# EAGLE design moth_v3.0 (EAGLE 9.5.2)
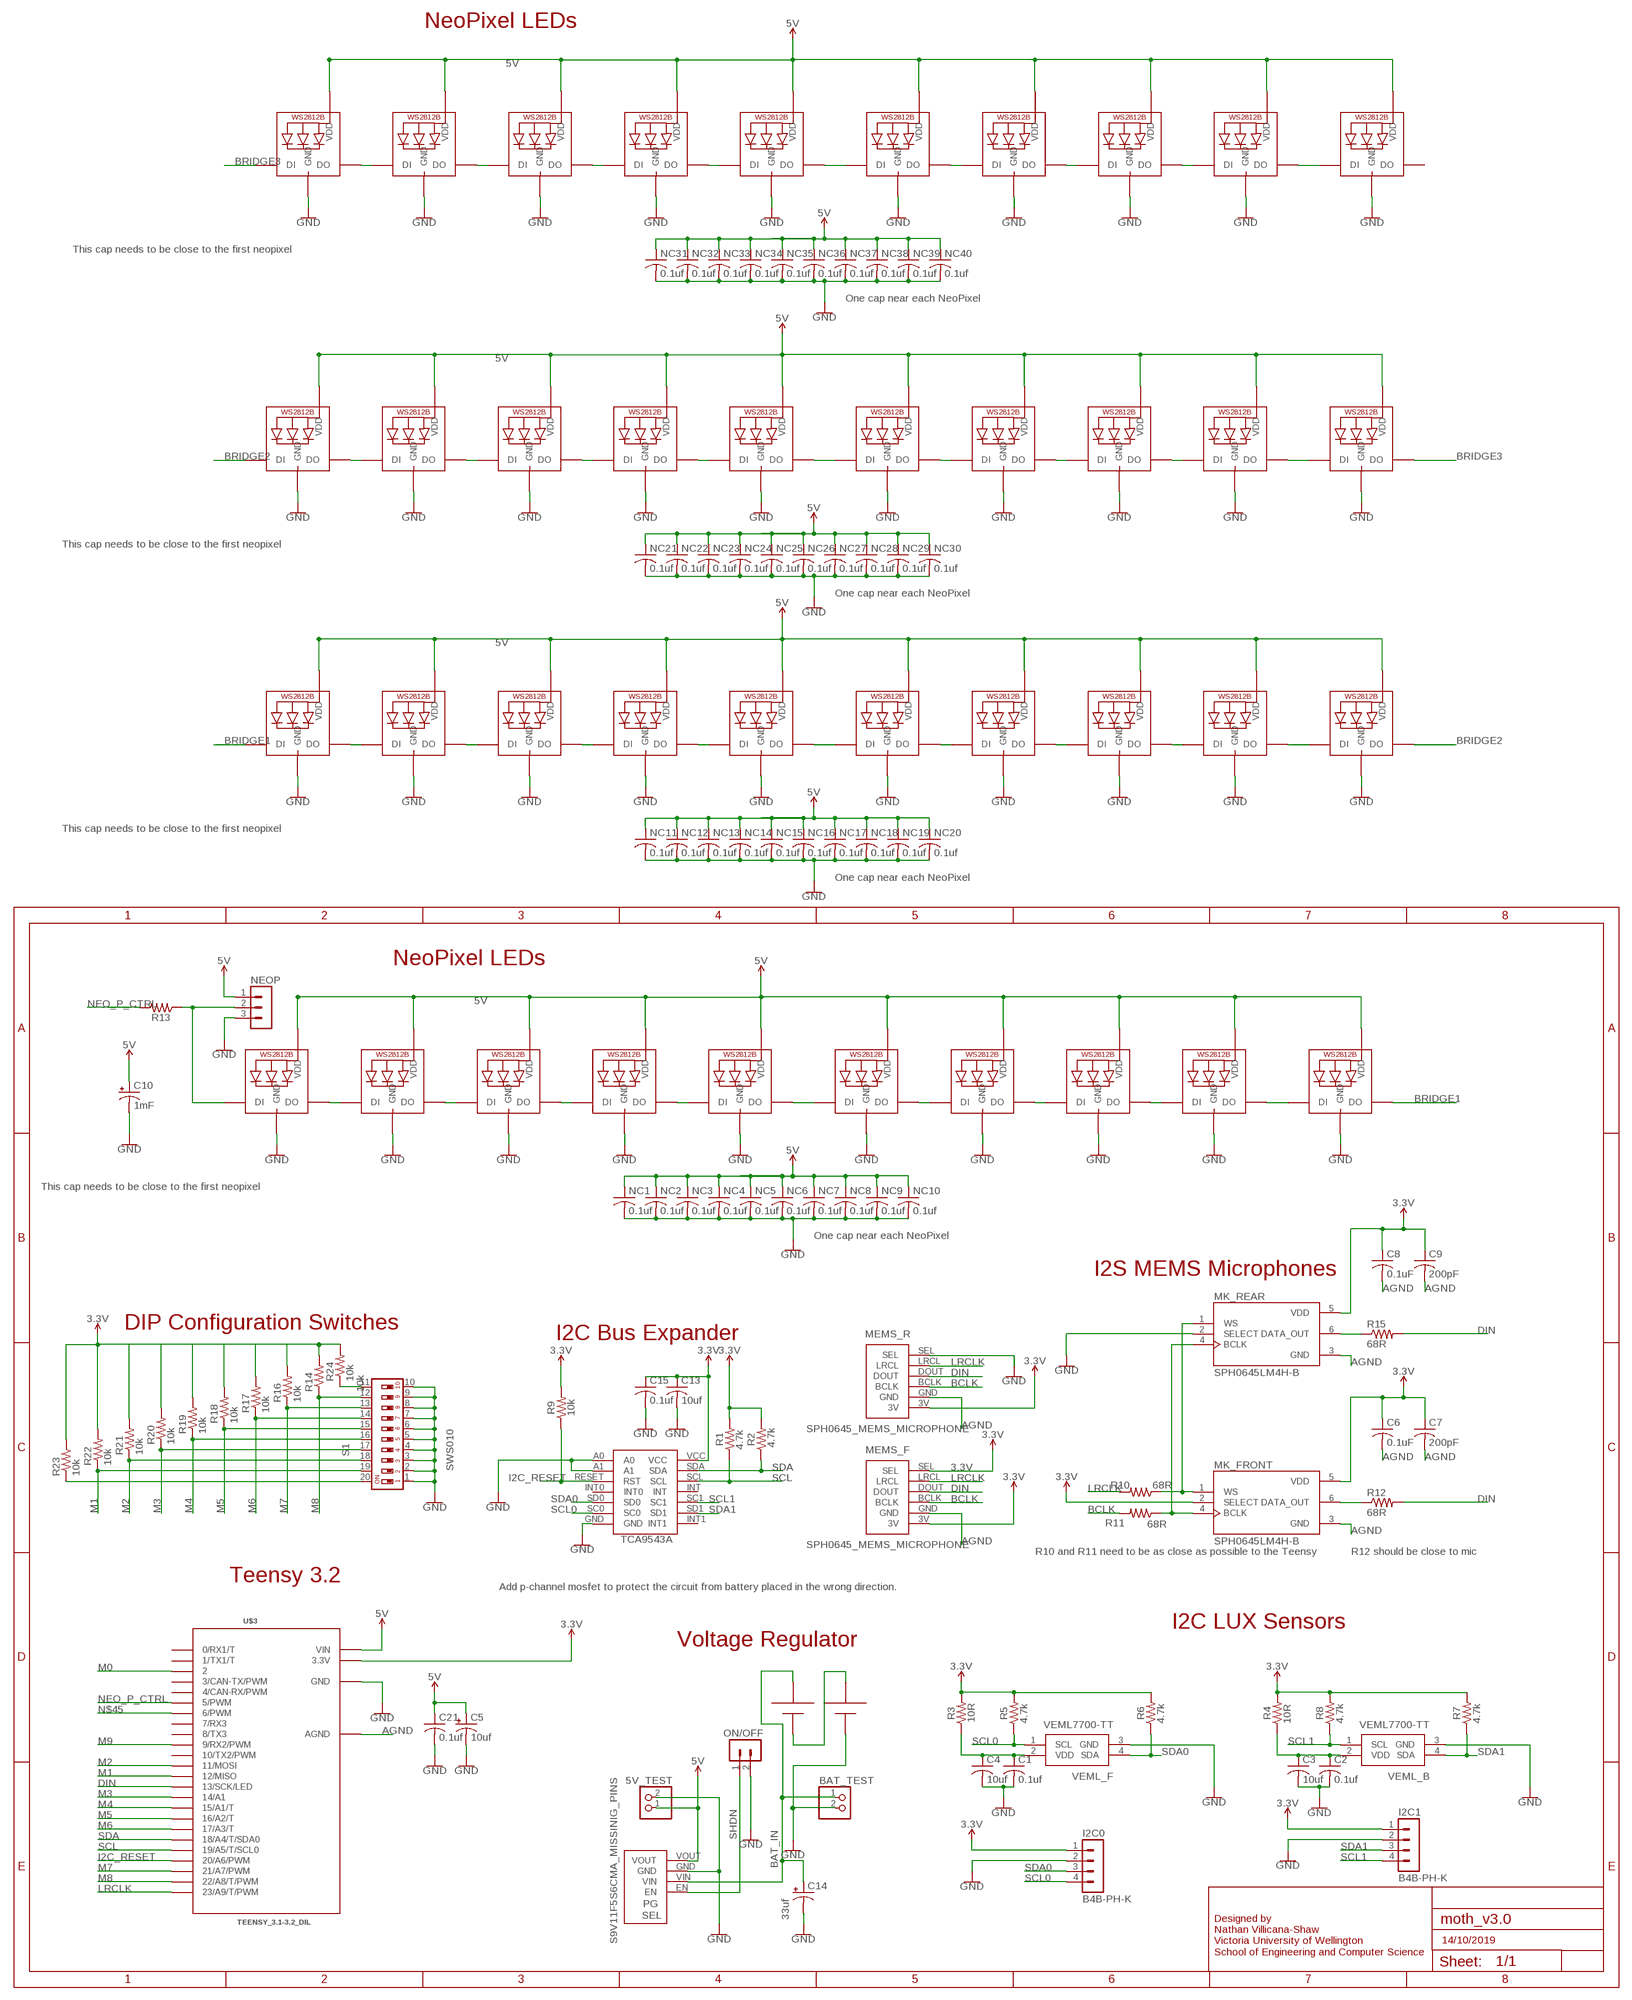
[diagram p0: schematic, sheet 1]

## Parts
5V_TEST  PINHD-1X2  [1X02]
BAT_TEST  PINHD-1X2  [1X02]
C1  0.1uf  C-USC1206K  [C1206K]
C2  0.1uf  C-USC1206K  [C1206K]
C3  10uf  C-USC1206K  [C1206K]
C4  10uf  C-USC1206K  [C1206K]
C5  10uf  CPOL-USE2.5-6  [E2,5-6]
C6  0.1uF  C-USC1206K  [C1206K]
C7  200pF  C-USC1206K  [C1206K]
C8  0.1uF  C-USC1206K  [C1206K]
C9  200pF  C-USC1206K  [C1206K]
C10  1mF  1000UF-RADIAL-5MM-25V-20%  [CPOL-RADIAL-5MM-10MM]
C13  10uf  C-USC1206K  [C1206K]
C14  33uf  CPOL-USE2-5  [E2-5]
C15  0.1uf  C-USC1206K  [C1206K]
C21  0.1uf  C-USC1206K  [C1206K]
I2C0  B4B-PH-K  [B4B-PH-K]
I2C1  B4B-PH-K  [B4B-PH-K]
MEMS_F  SPH0645_MEMS_MICROPHONE  [SPH0645]
MEMS_R  SPH0645_MEMS_MICROPHONE  [SPH0645]
MK_FRONT  SPH0645LM4H-B  [MIC_SPH0645LM4H-B]
MK_REAR  SPH0645LM4H-B  [MIC_SPH0645LM4H-B]
NC1  0.1uf  C-USC1206K  [C1206K]
NC2  0.1uf  C-USC1206K  [C1206K]
NC3  0.1uf  C-USC1206K  [C1206K]
NC4  0.1uf  C-USC1206K  [C1206K]
NC5  0.1uf  C-USC1206K  [C1206K]
NC6  0.1uf  C-USC1206K  [C1206K]
NC7  0.1uf  C-USC1206K  [C1206K]
NC8  0.1uf  C-USC1206K  [C1206K]
NC9  0.1uf  C-USC1206K  [C1206K]
NC10  0.1uf  C-USC1206K  [C1206K]
NC11  0.1uf  C-USC1206K  [C1206K]
NC12  0.1uf  C-USC1206K  [C1206K]
NC13  0.1uf  C-USC1206K  [C1206K]
NC14  0.1uf  C-USC1206K  [C1206K]
NC15  0.1uf  C-USC1206K  [C1206K]
NC16  0.1uf  C-USC1206K  [C1206K]
NC17  0.1uf  C-USC1206K  [C1206K]
NC18  0.1uf  C-USC1206K  [C1206K]
NC19  0.1uf  C-USC1206K  [C1206K]
NC20  0.1uf  C-USC1206K  [C1206K]
NC21  0.1uf  C-USC1206K  [C1206K]
NC22  0.1uf  C-USC1206K  [C1206K]
NC23  0.1uf  C-USC1206K  [C1206K]
NC24  0.1uf  C-USC1206K  [C1206K]
NC25  0.1uf  C-USC1206K  [C1206K]
NC26  0.1uf  C-USC1206K  [C1206K]
NC27  0.1uf  C-USC1206K  [C1206K]
NC28  0.1uf  C-USC1206K  [C1206K]
NC29  0.1uf  C-USC1206K  [C1206K]
NC30  0.1uf  C-USC1206K  [C1206K]
NC31  0.1uf  C-USC1206K  [C1206K]
NC32  0.1uf  C-USC1206K  [C1206K]
NC33  0.1uf  C-USC1206K  [C1206K]
NC34  0.1uf  C-USC1206K  [C1206K]
NC35  0.1uf  C-USC1206K  [C1206K]
NC36  0.1uf  C-USC1206K  [C1206K]
NC37  0.1uf  C-USC1206K  [C1206K]
NC38  0.1uf  C-USC1206K  [C1206K]
NC39  0.1uf  C-USC1206K  [C1206K]
NC40  0.1uf  C-USC1206K  [C1206K]
NEO1  WS2812B5050  [WS2812B]
NEO2  WS2812B5050  [WS2812B]
NEO3  WS2812B5050  [WS2812B]
NEO4  WS2812B5050  [WS2812B]
NEO5  WS2812B5050  [WS2812B]
NEO6  WS2812B5050  [WS2812B]
NEO7  WS2812B5050  [WS2812B]
NEO8  WS2812B5050  [WS2812B]
NEO9  WS2812B5050  [WS2812B]
NEO10  WS2812B5050  [WS2812B]
NEO11  WS2812B5050  [WS2812B]
NEO12  WS2812B5050  [WS2812B]
NEO13  WS2812B5050  [WS2812B]
NEO14  WS2812B5050  [WS2812B]
NEO15  WS2812B5050  [WS2812B]
NEO16  WS2812B5050  [WS2812B]
NEO17  WS2812B5050  [WS2812B]
NEO18  WS2812B5050  [WS2812B]
NEO19  WS2812B5050  [WS2812B]
NEO20  WS2812B5050  [WS2812B]
NEO21  WS2812B5050  [WS2812B]
NEO22  WS2812B5050  [WS2812B]
NEO23  WS2812B5050  [WS2812B]
NEO24  WS2812B5050  [WS2812B]
NEO25  WS2812B5050  [WS2812B]
NEO26  WS2812B5050  [WS2812B]
NEO27  WS2812B5050  [WS2812B]
NEO28  WS2812B5050  [WS2812B]
NEO29  WS2812B5050  [WS2812B]
NEO30  WS2812B5050  [WS2812B]
NEO31  WS2812B5050  [WS2812B]
NEO32  WS2812B5050  [WS2812B]
NEO33  WS2812B5050  [WS2812B]
NEO34  WS2812B5050  [WS2812B]
NEO35  WS2812B5050  [WS2812B]
NEO36  WS2812B5050  [WS2812B]
NEO37  WS2812B5050  [WS2812B]
NEO38  WS2812B5050  [WS2812B]
NEO39  WS2812B5050  [WS2812B]
NEO40  WS2812B5050  [WS2812B]
NEOP  B3B-PH-K  [B3B-PH-K]
ON/OFF  B2B-PH-K  [B2B-PH-K]
R1  4.7k  R-US_R1206W  [R1206W]
R2  4.7k  R-US_R1206W  [R1206W]
R3  10R  R-US_R1206W  [R1206W]
R4  10R  R-US_R1206W  [R1206W]
R5  4.7k  R-US_R1206W  [R1206W]
R6  4.7k  R-US_R1206W  [R1206W]
R7  4.7k  R-US_R1206W  [R1206W]
R8  4.7k  R-US_R1206W  [R1206W]
R9  10k  R-US_R1206W  [R1206W]
R10  68R  R-US_M1206  [M1206]
R11  68R  R-US_M1206  [M1206]
R12  68R  R-US_M1206  [M1206]
R13  300 R  R-US_R1206W  [R1206W]
R14  10k  R-US_R1206W  [R1206W]
R15  68R  R-US_M1206  [M1206]
R16  10k  R-US_R1206W  [R1206W]
R17  10k  R-US_R1206W  [R1206W]
R18  10k  R-US_R1206W  [R1206W]
R19  10k  R-US_R1206W  [R1206W]
R20  10k  R-US_R1206W  [R1206W]
R21  10k  R-US_R1206W  [R1206W]
R22  10k  R-US_R1206W  [R1206W]
R23  10k  R-US_R1206W  [R1206W]
R24  10k  R-US_R1206W  [R1206W]
S1  SWS010  [SMS-010]
U$1  TCA9543A  [SO14]
U$2  BK-18650-PC4  [18650-PC4]
U$3  TEENSY_3.1-3.2_DIL  [TEENSY_3.0-3.2&LC_DIL]
U$6  S9V11F5S6CMA_MISSINIG_PINS  [S9V11F3S5CMA_MISSING_PINS]
VEML_B  VEML7700-TT  [VEML7700]
VEML_F  VEML7700-TT  [VEML7700]

## Nets
3.3V: C6.1 C7.1 C8.1 C9.1 C13.1 C15.1 I2C0.1 I2C1.1 MEMS_F.3V MEMS_F.SEL MEMS_R.3V MK_FRONT.2(SELECT) MK_FRONT.5(VDD) MK_REAR.5(VDD) R1.2 R2.2 R3.2 R4.2 R5.2 R6.2 R7.2 R8.2 R9.2 R14.2 R22.2 R23.2 R24.2 U$1.VCC U$3.3.3V
5V: 5V_TEST.1 C5.+ C10.+ C21.1 NC1.1 NC2.1 NC3.1 NC4.1 NC5.1 NC6.1 NC7.1 NC8.1 NC9.1 NC10.1 NC11.1 NC12.1 NC13.1 NC14.1 NC15.1 NC16.1 NC17.1 NC18.1 NC19.1 NC20.1 NC21.1 NC22.1 NC23.1 NC24.1 NC25.1 NC26.1 NC27.1 NC28.1 NC29.1 NC30.1 NC31.1 NC32.1 NC33.1 NC34.1 NC35.1 NC36.1 NC37.1 NC38.1 NC39.1 NC40.1 NEO1.1-VDD(VDD) NEO2.1-VDD(VDD) NEO3.1-VDD(VDD) NEO4.1-VDD(VDD) NEO5.1-VDD(VDD) NEO6.1-VDD(VDD) NEO7.1-VDD(VDD) NEO8.1-VDD(VDD) NEO9.1-VDD(VDD) NEO10.1-VDD(VDD) NEO11.1-VDD(VDD) NEO12.1-VDD(VDD) NEO13.1-VDD(VDD) NEO14.1-VDD(VDD) NEO15.1-VDD(VDD) NEO16.1-VDD(VDD) NEO17.1-VDD(VDD) NEO18.1-VDD(VDD) NEO19.1-VDD(VDD) NEO20.1-VDD(VDD) NEO21.1-VDD(VDD) NEO22.1-VDD(VDD) NEO23.1-VDD(VDD) NEO24.1-VDD(VDD) NEO25.1-VDD(VDD) NEO26.1-VDD(VDD) NEO27.1-VDD(VDD) NEO28.1-VDD(VDD) NEO29.1-VDD(VDD) NEO30.1-VDD(VDD) NEO31.1-VDD(VDD) NEO32.1-VDD(VDD) NEO33.1-VDD(VDD) NEO34.1-VDD(VDD) NEO35.1-VDD(VDD) NEO36.1-VDD(VDD) NEO37.1-VDD(VDD) NEO38.1-VDD(VDD) NEO39.1-VDD(VDD) NEO40.1-VDD(VDD) NEOP.1 U$3.VIN U$6.VOUT
AGND: C6.2 C7.2 C8.2 C9.2 MEMS_F.GND MEMS_R.GND MK_FRONT.3(GND) MK_REAR.3(GND) U$3.AGND
BAT_IN: BAT_TEST.1 C14.+ U$2.+1 U$6.VIN
BCLK: MEMS_F.BCLK MEMS_R.BCLK R11.2
BCLK_P: MK_FRONT.4(BCLK) MK_REAR.4(BCLK) R11.1
BRIDGE1: NEO10.2-DOUT(DO) NEO14.4-DIN(DI)
BRIDGE2: NEO20.2-DOUT(DO) NEO24.4-DIN(DI)
BRIDGE3: NEO30.2-DOUT(DO) NEO34.4-DIN(DI)
DIN: MEMS_F.DOUT MEMS_R.DOUT R12.2 R15.2 U$3.13(13/SCK/LED)
GND: 5V_TEST.2 BAT_TEST.2 C1.2 C2.2 C3.2 C4.2 C5.- C10.- C13.2 C14.- C15.2 C21.2 I2C0.2 I2C1.2 MEMS_R.SEL MK_REAR.2(SELECT) NC1.2 NC2.2 NC3.2 NC4.2 NC5.2 NC6.2 NC7.2 NC8.2 NC9.2 NC10.2 NC11.2 NC12.2 NC13.2 NC14.2 NC15.2 NC16.2 NC17.2 NC18.2 NC19.2 NC20.2 NC21.2 NC22.2 NC23.2 NC24.2 NC25.2 NC26.2 NC27.2 NC28.2 NC29.2 NC30.2 NC31.2 NC32.2 NC33.2 NC34.2 NC35.2 NC36.2 NC37.2 NC38.2 NC39.2 NC40.2 NEO1.3-GND(GND) NEO2.3-GND(GND) NEO3.3-GND(GND) NEO4.3-GND(GND) NEO5.3-GND(GND) NEO6.3-GND(GND) NEO7.3-GND(GND) NEO8.3-GND(GND) NEO9.3-GND(GND) NEO10.3-GND(GND) NEO11.3-GND(GND) NEO12.3-GND(GND) NEO13.3-GND(GND) NEO14.3-GND(GND) NEO15.3-GND(GND) NEO16.3-GND(GND) NEO17.3-GND(GND) NEO18.3-GND(GND) NEO19.3-GND(GND) NEO20.3-GND(GND) NEO21.3-GND(GND) NEO22.3-GND(GND) NEO23.3-GND(GND) NEO24.3-GND(GND) NEO25.3-GND(GND) NEO26.3-GND(GND) NEO27.3-GND(GND) NEO28.3-GND(GND) NEO29.3-GND(GND) NEO30.3-GND(GND) NEO31.3-GND(GND) NEO32.3-GND(GND) NEO33.3-GND(GND) NEO34.3-GND(GND) NEO35.3-GND(GND) NEO36.3-GND(GND) NEO37.3-GND(GND) NEO38.3-GND(GND) NEO39.3-GND(GND) NEO40.3-GND(GND) NEOP.3 ON/OFF.2 S1.1 S1.2 S1.3 S1.4 S1.5 S1.6 S1.7 S1.8 S1.9 S1.10 U$1.A0 U$1.A1 U$1.GND U$2.-2 U$3.GND U$6.GND VEML_B.3(GND) VEML_F.3(GND)
I2C_RESET: R9.1 U$1.RESET(RST) U$3.20/A6(20/A6/PWM)
LRCLK: MEMS_F.LRCL MEMS_R.LRCL R10.2 U$3.23/A9(23/A9/T/PWM)
LRCLK_P: MK_FRONT.1(WS) MK_REAR.1(WS) R10.1
M0: U$3.2
M1: R22.1 S1.19 U$3.12(12/MISO)
M2: R21.1 S1.18 U$3.11(11/MOSI)
M3: R20.1 S1.17 U$3.14/A0(14/A1)
M4: R19.1 S1.16 U$3.15/A1(15/A1/T)
M5: R18.1 S1.15 U$3.16/A2(16/A2/T)
M6: R17.1 S1.14 U$3.17/A3(17/A3/T)
M7: R16.1 S1.13 U$3.21/A7(21/A7/PWM)
M8: R14.1 S1.12 U$3.22/A8(22/A8/T/PWM)
M9: U$3.9(9/RX2/PWM)
N$1: C1.1 C4.1 R3.1 VEML_F.2(VDD)
N$2: C2.1 C3.1 R4.1 VEML_B.2(VDD)
N$3: MK_FRONT.6(DATA_OUT) R12.1
N$4: NEO2.2-DOUT(DO) NEO3.4-DIN(DI)
N$5: NEO5.2-DOUT(DO) NEO6.4-DIN(DI)
N$6: NEO9.2-DOUT(DO) NEO10.4-DIN(DI)
N$7: NEO11.2-DOUT(DO) NEO12.4-DIN(DI)
N$8: NEO4.2-DOUT(DO) NEO5.4-DIN(DI)
N$9: NEO15.2-DOUT(DO) NEO16.4-DIN(DI)
N$10: NEO3.2-DOUT(DO) NEO4.4-DIN(DI)
N$11: NEO7.2-DOUT(DO) NEO8.4-DIN(DI)
N$12: NEO8.2-DOUT(DO) NEO9.4-DIN(DI)
N$13: NEO17.2-DOUT(DO) NEO18.4-DIN(DI)
N$14: NEO18.2-DOUT(DO) NEO19.4-DIN(DI)
N$15: NEO11.4-DIN(DI) NEO16.2-DOUT(DO)
N$16: NEO13.2-DOUT(DO) NEO17.4-DIN(DI)
N$17: MK_REAR.6(DATA_OUT) R15.1
N$18: NEO12.2-DOUT(DO) NEO13.4-DIN(DI)
N$19: NEO19.2-DOUT(DO) NEO20.4-DIN(DI)
N$20: U$2.+2 U$2.-1
N$21: NEO21.2-DOUT(DO) NEO22.4-DIN(DI)
N$22: R21.2
N$23: NEO6.2-DOUT(DO) NEO7.4-DIN(DI)
N$24: R20.2
N$25: R19.2
N$26: R18.2
N$27: R17.2
N$28: R16.2
N$29: NEO25.2-DOUT(DO) NEO26.4-DIN(DI)
N$30: NEO27.2-DOUT(DO) NEO28.4-DIN(DI)
N$31: NEO28.2-DOUT(DO) NEO29.4-DIN(DI)
N$32: NEO21.4-DIN(DI) NEO26.2-DOUT(DO)
N$33: NEO23.2-DOUT(DO) NEO27.4-DIN(DI)
N$34: NEO22.2-DOUT(DO) NEO23.4-DIN(DI)
N$35: NEO29.2-DOUT(DO) NEO30.4-DIN(DI)
N$36: NEO31.2-DOUT(DO) NEO32.4-DIN(DI)
N$37: NEO35.2-DOUT(DO) NEO36.4-DIN(DI)
N$38: NEO37.2-DOUT(DO) NEO38.4-DIN(DI)
N$39: NEO38.2-DOUT(DO) NEO39.4-DIN(DI)
N$40: NEO31.4-DIN(DI) NEO36.2-DOUT(DO)
N$41: NEO33.2-DOUT(DO) NEO37.4-DIN(DI)
N$42: NEO32.2-DOUT(DO) NEO33.4-DIN(DI)
N$43: NEO39.2-DOUT(DO) NEO40.4-DIN(DI)
N$44: R24.1 S1.11
N$45: U$3.6(6/PWM)
N$46: R23.1 S1.20
NEO_P1: NEO1.2-DOUT(DO) NEO2.4-DIN(DI)
NEO_P2: NEO14.2-DOUT(DO) NEO15.4-DIN(DI)
NEO_P3: NEO24.2-DOUT(DO) NEO25.4-DIN(DI)
NEO_P4: NEO34.2-DOUT(DO) NEO35.4-DIN(DI)
NEO_P_CTRL: R13.2 U$3.5(5/PWM)
NEO_P_CTRL_INT: NEO1.4-DIN(DI) NEOP.2 R13.1
SCL: R1.1 U$1.SCL U$3.19/A5(19/A5/T/SCL0)
SCL0: I2C0.4 R5.1 U$1.SC0 VEML_F.1(SCL)
SCL1: I2C1.4 R8.1 U$1.SC1 VEML_B.1(SCL)
SDA: R2.1 U$1.SDA U$3.18/A4(18/A4/T/SDA0)
SDA0: I2C0.3 R6.1 U$1.SD0 VEML_F.4(SDA)
SDA1: I2C1.3 R7.1 U$1.SD1 VEML_B.4(SDA)
SHDN: ON/OFF.1 U$6.EN
Unconnected: NEO40.2-DOUT(DO) U$1.INT U$1.INT0 U$1.INT1 U$3.0(0/RX1/T) U$3.1(1/TX1/T) U$3.3(3/CAN-TX/PWM) U$3.4(4/CAN-RX/PWM) U$3.7(7/RX3) U$3.8(8/TX3) U$3.10(10/TX2/PWM)

## Notes on the sheet
- NeoPixel LEDs
- This cap needs to be close to the first neopixel
- One cap near each NeoPixel
- This cap needs to be close to the first neopixel
- One cap near each NeoPixel
- This cap needs to be close to the first neopixel
- One cap near each NeoPixel
- NeoPixel LEDs
- This cap needs to be close to the first neopixel
- One cap near each NeoPixel
- I2S MEMS Microphones
- DIP Configuration Switches
- I2C Bus Expander
- 10k
- 4.7k | 4.7k
- R10 and R11 need to be as close as possible to the Teensy | R12 should be close to mic
- Teensy 3.2
- Add p-channel mosfet to protect the circuit from battery placed in the wrong direction.
- I2C LUX Sensors
- Voltage Regulator
- 10R | 4.7k | 4.7k | 10R | 4.7k | 4.7k
- 14/10/2019
- Designed by
  Nathan Villicana-Shaw
  Victoria University of Wellington
  School of Engineering and Computer Science

## Library data of the parts
5V_TEST BAT_TEST = pinhead:PINHD-1X2: PIN HEADER
C1-C4 C6-C9 C13 C15 C21 NC1-NC40 = adafruit:C-US: CAPACITOR, American symbol
C5 C14 = adafruit:CPOL-US: POLARIZED CAPACITOR, American symbol
C10 = SparkFun-Capacitors:1000UF: 1,000µF/1mF ceramic capacitors A capacitor is a passive two-terminal electrical component used to store electrical energy temporarily in an electric field. CAP-08070; PROD_ID: CAP-09538
I2C0 I2C1 = con-jst-ph:B4B-PH-K: HEADER
MEMS_F MEMS_R = nathans-custom-parts:SPH0645_MEMS_MICROPHONE
MK_FRONT MK_REAR = SPH0645LM4H-B:SPH0645LM4H-B: Mic Mems Digital I2s Omni -26db; DESCRIPTION: Mic Mems Digital I2s Omni -26db; DIGI-KEY_PART_NUMBER: 423-1405-1-ND; DIGI-KEY_PURCHASE_URL: https://www.digikey.co.nz/product-detail/en/knowles/SPH0645LM4H-B/423-1405-1-ND/5332432?utm_source=snapeda&utm_medium=aggregator&utm_campaign=symbol; MF: Knowles; MP: SPH0645LM4H-B; PACKAGE: SIP-7 Bourns
NEO1-NEO40 = adafruit:WS2812B
NEOP = con-jst-ph:B3B-PH-K: HEADER
ON/OFF = con-jst-ph:B2B-PH-K: HEADER
R1-R24 = adafruit:R-US_: RESISTOR, American symbol
S1 = smd-special:SWS010: SMD Dip Switch 10 pol.
U$1 = nathans-custom-parts:TCA9543A
U$2 = BK-18650-PC4:BK-18650-PC4; AVAILABILITY: Unavailable; DESCRIPTION: Holder Batt Li-Ion 2cell 4pc Pin; MF: MPD; MP: BK-18650-PC4; PACKAGE: None; PRICE: None
U$3 = Teensy_3_and_LC_Series_Boards_v1.4:TEENSY_3.1-3.2_DIL: Teensy 3.1 or 3.2 in a DIL Layout.
U$6 = nathans-custom-parts:S9V11F5S6CMA_MISSINIG_PINS
VEML_B VEML_F = VEML7700-TT:VEML7700-TT: 16Bit Ambient Light Sensor I2C 6.8x2.3mm Source: Datasheet <https://www.arrow.com/en/products/veml7700-tt/vishay>; DESCRIPTION: 16Bit Ambient Light Sensor I2C 6.8x2.3mm; HEIGHT: mm; MANUFACTURER_NAME: Vishay; MANUFACTURER_PART_NUMBER: VEML7700-TT; MOUSER_PART_NUMBER: 78-VEML7700-TT; MOUSER_PRICE-STOCK: https://www.mouser.com/Search/Refine.aspx?Keyword=78-VEML7700-TT; RS_PART_NUMBER: 1226791P; RS_PRICE-STOCK: http://uk.rs-online.com/web/p/products/1226791P

## Net classes
0 default: width 0.203 mm, drill 0.254 mm, clearance 0.203 mm

## Board
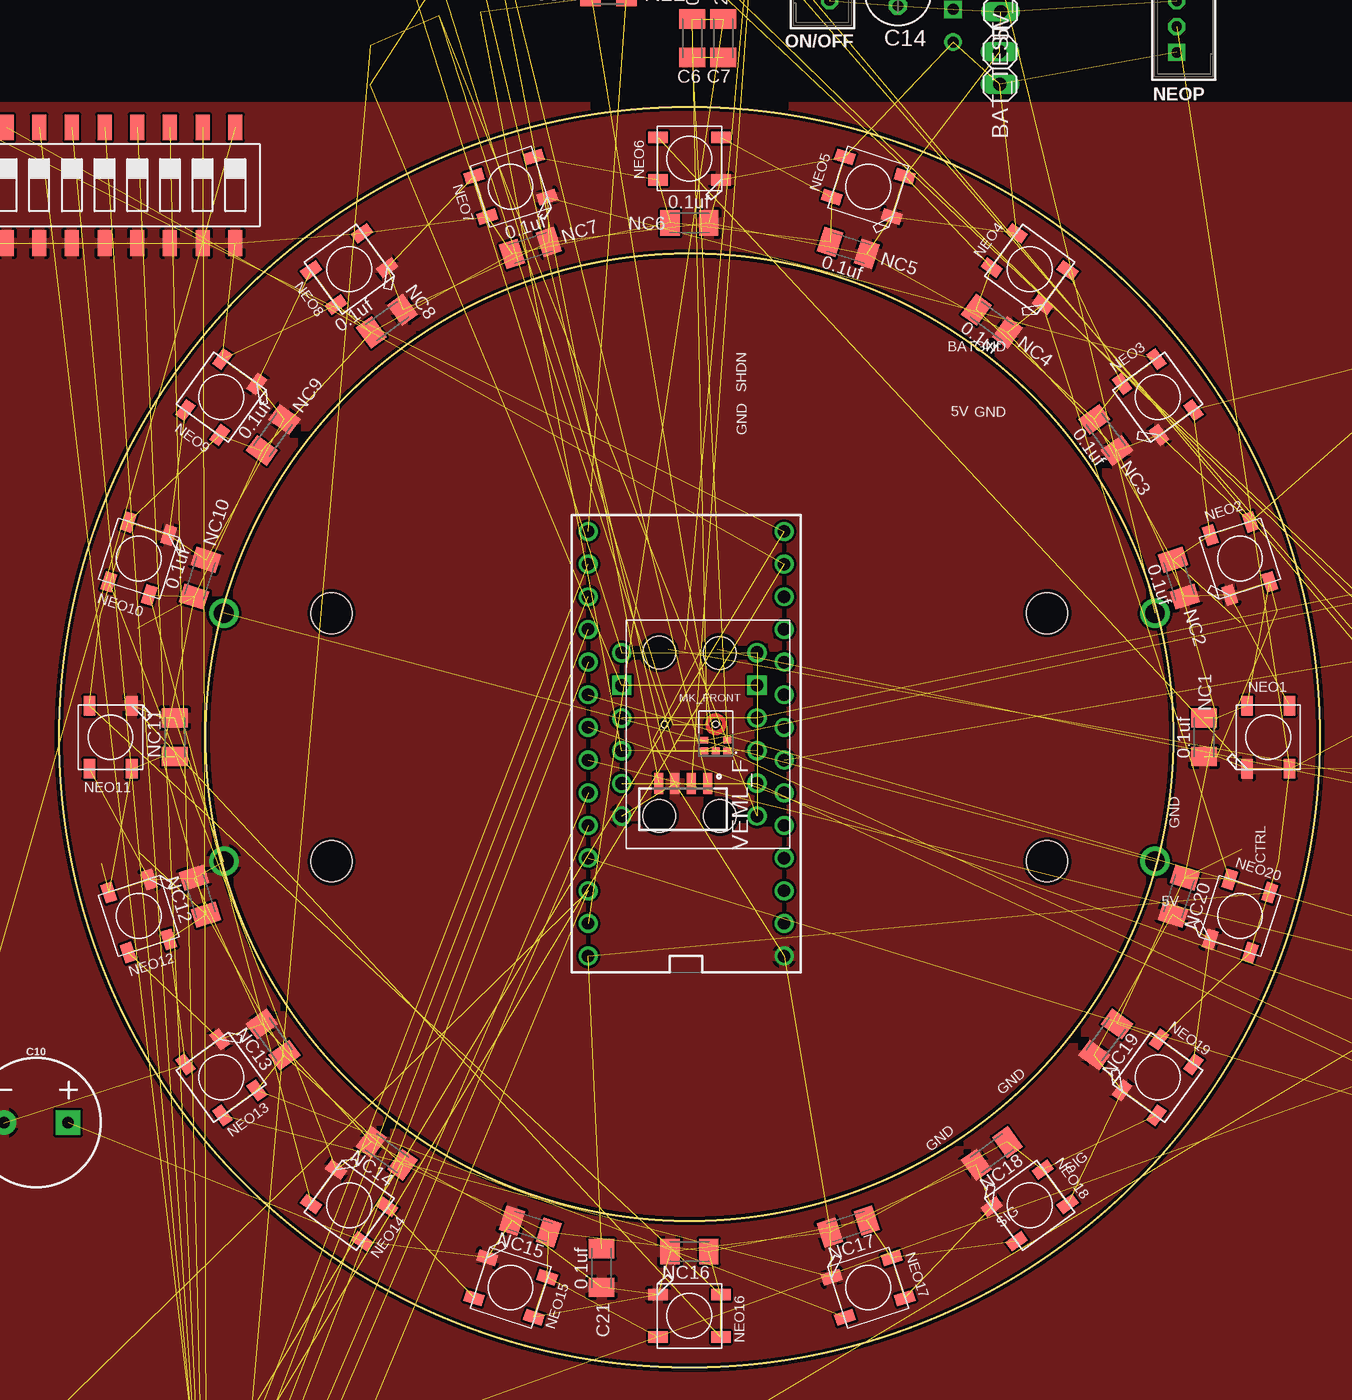
[diagram p1: board, top side]
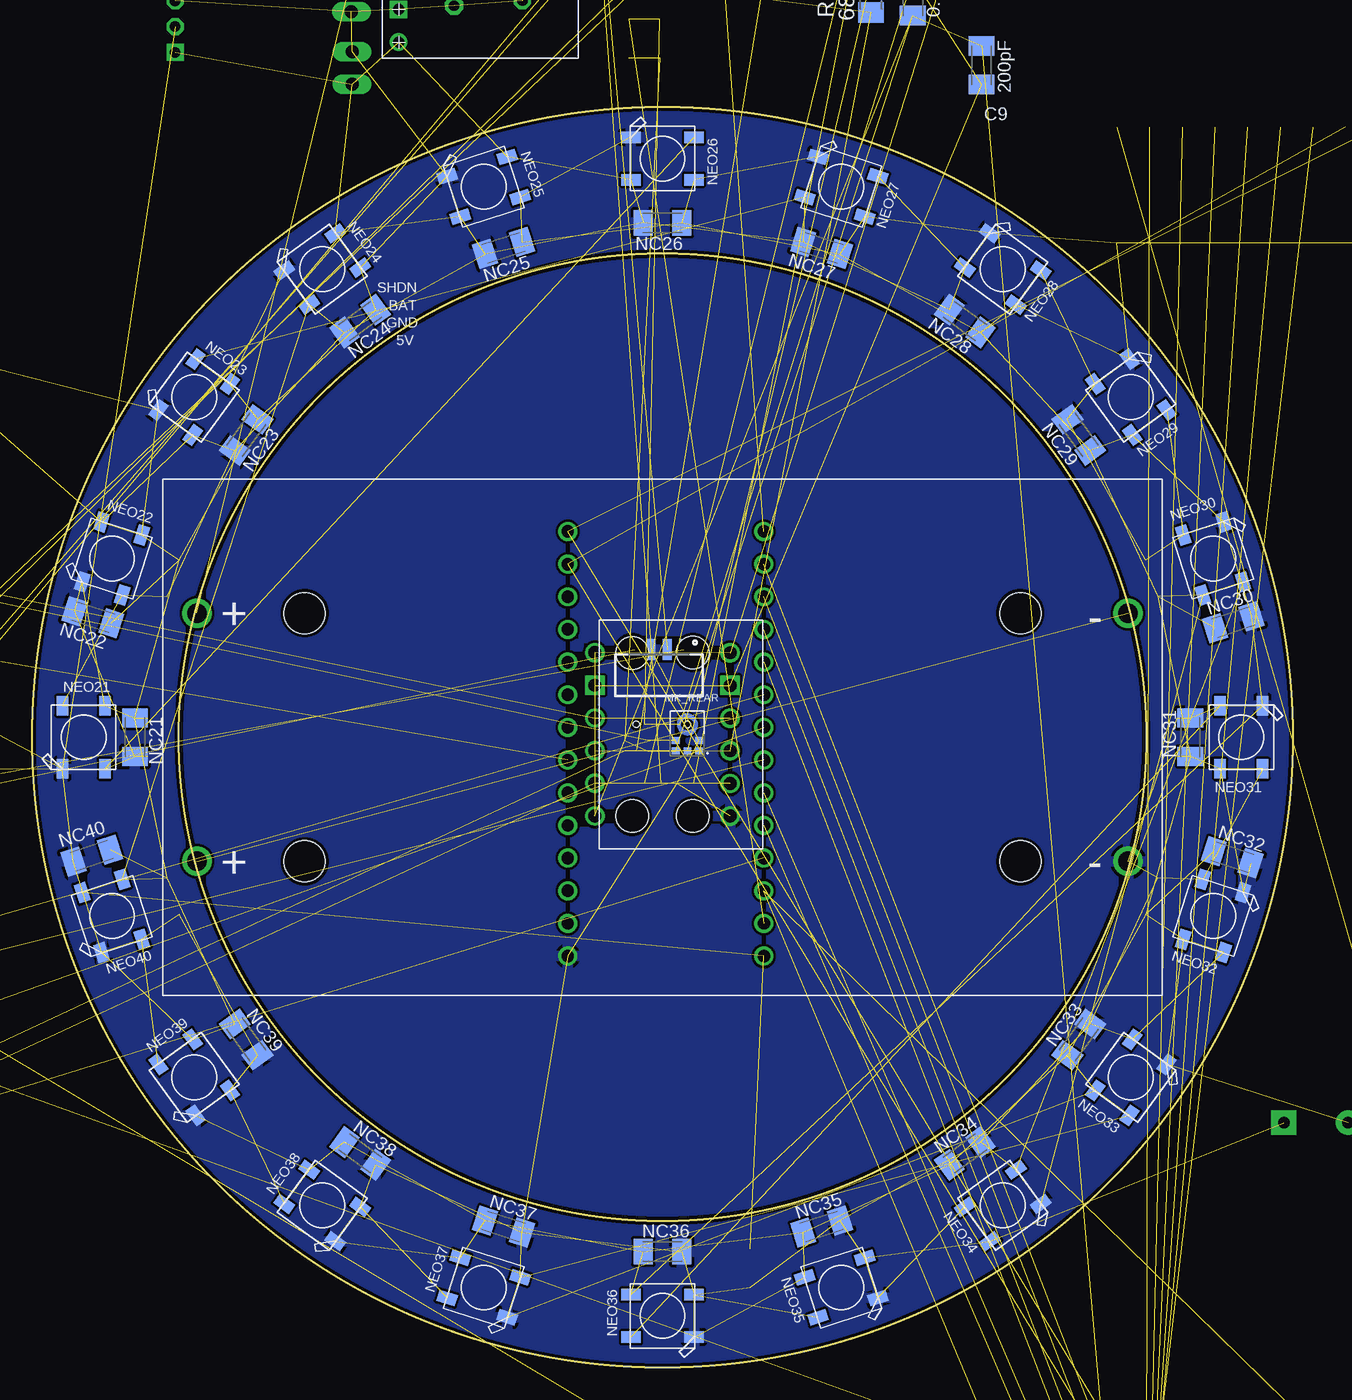
[diagram p2: board, bottom side, seen from below]

Size 98 x 98 mm. Coordinates in mm from the lower left corner, seen from the top.
Outline: circle at 49,49 radius 49
Outline: circle at 49,49 radius 37.59
Copper layers (1*16): Top 0.035mm / dielectric 1.5mm / Bottom 0.035mm
Design rules "SeeedStudio_2layer_DRU_no_angle_20140221": minimum track width 6mil, minimum drill 12mil, track to track 6mil, track to pad 6mil, pad to pad 6mil, via to via 6mil, smd to smd 0mil, copper to edge 10mil, drill to drill 10mil, minimum pad ring 10mil, minimum via ring 6mil, stop-mask expansion 2mil, vias tented up to drill 100mil, thermal gap 10mil

### Footprints (pad centres in the part's own frame; a part is rotated, then mirrored left to right if it is on the bottom)
1X02 = drill 1.016 long: 1 -1.27,0; 2 1.27,0
C1206K = smd 1.5 x 2: 1 -1.5,0; 2 1.5,0
E2,5-6 = drill 0.813 pad 1.778: + -1.27,0 | drill 0.813 pad 1.778 octagon: - 1.27,0
CPOL-RADIAL-5MM-10MM = drill 0.9 pad 1.93 square: + 2.5,0 | drill 0.9 pad 1.93: - -2.5,0
E2-5 = drill 0.813 pad 1.422: + -1.016,0 | drill 0.813 pad 1.422 octagon: - 1.016,0
B4B-PH-K = drill 0.813 square: 1 -3,0 | drill 0.813 octagon: 2 -1,0; 3 1,0; 4 3,0
SPH0645 = drill 1: 3V 12.7,0; BCLK 7.62,0; DOUT 5.08,0; LRCL 2.54,0; SEL 0,0 | drill 1 square: GND 10.16,0 | hole 2.54: 0,7.62; 12.7,7.62
MIC_SPH0645LM4H-B = smd 0.6 x 0.522: 1 -0.9,2.074; 2 -0.9,1.252; 4 0.9,1.252; 5 0.9,2.074; 6 0,2.074 | smd 0.1 x 0.1: 3 0.65,0.02 | hole 0.5: 0,0
WS2812B = smd 1.5 x 0.9: 1-VDD 2.45,-1.65; 2-DOUT 2.45,1.65; 3-GND -2.45,1.65; 4-DIN -2.45,-1.65
B3B-PH-K = drill 0.813 square: 1 -2,0 | drill 0.813 octagon: 2 0,0; 3 2,0
B2B-PH-K = drill 0.813 square: 1 -1,0 | drill 0.813 octagon: 2 1,0
R1206W = smd 1.8 x 1.2: 1 -1.499,0; 2 1.499,0
M1206 = smd 1.6 x 2: 1 -1.4,0; 2 1.4,0
SMS-010 = smd 1.092 x 2.007: 1 -11.43,-4.496; 2 -8.89,-4.496; 3 -6.35,-4.496; 4 -3.81,-4.496; 5 -1.27,-4.496; 6 1.27,-4.496; 7 3.81,-4.496; 8 6.35,-4.496; 9 8.89,-4.496; 10 11.43,-4.496; 11 11.43,4.496; 12 8.89,4.496; 13 6.35,4.496; 14 3.81,4.496; 15 1.27,4.496; 16 -1.27,4.496; 17 -3.81,4.496; 18 -6.35,4.496; 19 -8.89,4.496; 20 -11.43,4.496
SO14 = smd 0.66 x 2.032: A0 -3.81,-3.073; A1 -2.54,-3.073; GND 3.81,-3.073; INT 0,3.073; INT0 0,-3.073; INT1 3.81,3.073; RESET -1.27,-3.073; SC0 2.54,-3.073; SC1 1.27,3.073; SCL -1.27,3.073; SD0 1.27,-3.073; SD1 2.54,3.073; SDA -2.54,3.073; VCC -3.81,3.073
18650-PC4 = drill 1.524: +1 -36.195,9.652; +2 -36.195,-9.652; -1 36.195,9.652; -2 36.195,-9.652 | hole 3.2: -27.813,9.652; -27.813,-9.652; 27.813,-9.652; 27.813,9.652
TEENSY_3.0-3.2&LC_DIL = drill 0.965: 0 -7.62,13.97; 1 -7.62,11.43; 2 -7.62,8.89; 3 -7.62,6.35; 3.3V 7.62,11.43; 4 -7.62,3.81; 5 -7.62,1.27; 6 -7.62,-1.27; 7 -7.62,-3.81; 8 -7.62,-6.35; 9 -7.62,-8.89; 10 -7.62,-11.43; 11 -7.62,-13.97; 12 -7.62,-16.51; 13 7.62,-16.51; 14/A0 7.62,-13.97; 15/A1 7.62,-11.43; 16/A2 7.62,-8.89; 17/A3 7.62,-6.35; 18/A4 7.62,-3.81; 19/A5 7.62,-1.27; 20/A6 7.62,1.27; 21/A7 7.62,3.81; 22/A8 7.62,6.35; 23/A9 7.62,8.89; AGND 7.62,13.97; GND -7.62,16.51; VIN 7.62,16.51
S9V11F3S5CMA_MISSING_PINS = drill 0.85: EN 0,0; VIN 2.54,0; VOUT 7.62,0 | drill 0.85 square: GND 5.08,0
VEML7700 = smd 0.7 x 1.6: 1 1.495,-0.4; 2 2.765,-0.4; 3 4.035,-0.4; 4 5.305,-0.4

### Placement (x,y rotation side)
5V_TEST  73.13,101.03 90 top
BAT_TEST  73.18,106.69 270 top  (outside the outline)
C1  56.19,121.92 0 top  (outside the outline)
C2  56.18,121.93 180 bottom  (outside the outline)
C3  52.38,122.72 270 bottom  (outside the outline)
C4  52.37,122.72 270 top  (outside the outline)
C5  110.72,80.56 0 top  (outside the outline)
C6  49.22,103.35 90 top  (outside the outline)
C7  51.63,103.35 90 top  (outside the outline)
C8  29.54,106.61 90 bottom  (outside the outline)
C9  24.19,101.26 270 bottom
C10  -1.8,19.03 0 top
C13  21.02,135.07 0 top  (outside the outline)
C14  65.22,106.9 269 top  (outside the outline)
C15  21.05,132.52 0 top  (outside the outline)
C21  42.17,7.73 270 top
I2C0  29.61,133.17 270 top  (outside the outline)
I2C1  12.46,133.32 270 bottom  (outside the outline)
MEMS_F  54.26,42.88 90 top
MEMS_R  43.74,42.87 90 bottom
MK_FRONT  51.05,50.01 180 top
MK_REAR  47.07,50 180 bottom
NC1  89,49 270 top
NC2  87.04,61.36 288 top
NC3  81.36,72.51 306 top
NC4  72.51,81.36 324 top
NC5  61.36,87.04 342 top
NC6  49,89 0 top
NC7  36.64,87.04 18 top
NC8  25.49,81.36 36 top
NC9  16.64,72.51 54 top
NC10  10.96,61.36 72 top
NC11  9,49 90 top
NC12  10.96,36.64 108 top
NC13  16.64,25.49 126 top
NC14  25.49,16.64 144 top
NC15  36.64,10.96 162 top
NC16  49,9 180 top
NC17  61.36,10.96 198 top
NC18  72.51,16.64 216 top
NC19  81.36,25.49 234 top
NC20  87.04,36.64 252 top
NC21  90.02,49 270 bottom
NC22  93.28,58.34 162 bottom
NC23  81.36,72.51 234 bottom
NC24  72.51,81.36 216 bottom
NC25  61.36,87.04 198 bottom
NC26  49,89 180 bottom
NC27  36.64,87.04 162 bottom
NC28  25.49,81.36 144 bottom
NC29  16.64,72.51 126 bottom
NC30  4.64,57.95 18 bottom
NC31  7.98,49 90 bottom
NC32  4.72,39.66 342 bottom
NC33  16.64,25.49 54 bottom
NC34  25.49,16.64 36 bottom
NC35  36.64,10.96 18 bottom
NC36  49,9 0 bottom
NC37  61.36,10.96 342 bottom
NC38  72.51,16.64 324 bottom
NC39  81.36,25.49 306 bottom
NC40  93.36,39.8 198 bottom
NEO1  94,49 90 top
NEO2  91.8,62.91 108 top
NEO3  85.41,75.45 126 top
NEO4  75.45,85.41 144 top
NEO5  62.91,91.8 162 top
NEO6  49,94 180 top
NEO7  35.09,91.8 198 top
NEO8  22.55,85.41 216 top
NEO9  12.59,75.45 234 top
NEO10  6.2,62.91 252 top
NEO11  4,49 270 top
NEO12  6.2,35.09 288 top
NEO13  12.59,22.55 306 top
NEO14  22.55,12.59 324 top
NEO15  35.09,6.2 342 top
NEO16  49,4 0 top
NEO17  62.91,6.2 18 top
NEO18  75.45,12.59 36 top
NEO19  85.41,22.55 54 top
NEO20  91.8,35.09 72 top
NEO21  94,49 90 bottom
NEO22  91.8,62.91 72 bottom
NEO23  85.41,75.45 54 bottom
NEO24  75.45,85.41 36 bottom
NEO25  62.91,91.8 18 bottom
NEO26  49,94 0 bottom
NEO27  35.09,91.8 342 bottom
NEO28  22.55,85.41 324 bottom
NEO29  12.59,75.45 306 bottom
NEO30  6.2,62.91 288 bottom
NEO31  4,49 270 bottom
NEO32  6.2,35.09 252 bottom
NEO33  12.59,22.55 234 bottom
NEO34  22.55,12.59 216 bottom
NEO35  35.09,6.2 198 bottom
NEO36  49,4 180 bottom
NEO37  62.91,6.2 162 bottom
NEO38  75.45,12.59 144 bottom
NEO39  85.41,22.55 126 bottom
NEO40  91.8,35.09 108 bottom
NEOP  86.88,104.26 90 top  (outside the outline)
ON/OFF  59.9,107.28 270 top  (outside the outline)
R1  119.57,22.36 0 top  (outside the outline)
R2  120.82,29.7 0 top  (outside the outline)
R3  56.36,124.4 0 top  (outside the outline)
R4  56.37,124.41 180 bottom  (outside the outline)
R5  28.7,143.66 0 top  (outside the outline)
R6  28.71,141.6 0 top  (outside the outline)
R7  13.18,143.63 180 top  (outside the outline)
R8  13.18,141.57 180 top  (outside the outline)
R9  109.14,30.69 0 top  (outside the outline)
R10  118.97,15.96 180 top  (outside the outline)
R11  113.14,62.41 180 top  (outside the outline)
R12  42.72,106.85 0 top  (outside the outline)
R13  113.52,56.87 180 top  (outside the outline)
R14  12.93,-26.95 0 top  (outside the outline)
R15  32.79,106.76 270 bottom  (outside the outline)
R16  12.93,-24.41 0 top  (outside the outline)
R17  12.93,-21.87 0 top  (outside the outline)
R18  12.93,-19.33 0 top  (outside the outline)
R19  12.93,-16.79 0 top  (outside the outline)
R20  12.93,-14.25 0 top  (outside the outline)
R21  12.93,-11.71 0 top  (outside the outline)
R22  12.93,-9.17 0 top  (outside the outline)
R23  -20.34,-21.61 0 top  (outside the outline)
R24  -20.34,-27.71 0 top  (outside the outline)
S1  2.26,91.93 0 top
U$1  116.35,44.02 270 top  (outside the outline)
U$2  49,49 0 bottom
U$3  48.75,48.49 180 top
U$6  69.51,110.67 270 bottom  (outside the outline)
VEML_B  45.86,55.42 180 bottom
VEML_F  51.91,45 180 top

### Tracks (layer width: path | path; a pad name or v marks a point on that pad's centre or on a via)
3.3V  (28 unrouted)
5V  (86 unrouted)
AGND  (8 unrouted)
BAT_IN  (3 unrouted)
BCLK  (2 unrouted)
BCLK_P  (2 unrouted)
BRIDGE1  (1 unrouted)
BRIDGE2  (1 unrouted)
BRIDGE3  (1 unrouted)
DIN  (4 unrouted)
GND  (115 unrouted)
  pour Top: -9,98 102,98 102,-3 -9,-3
  pour Bottom: 70.77,97.9 101.91,66.75 101.91,28.93 69.65,-3.32 30.81,-3.32 -9.27,36.76 -8.96,97.92
I2C_RESET  (2 unrouted)
LRCLK  (3 unrouted)
LRCLK_P  (2 unrouted)
M1  (2 unrouted)
M2  (2 unrouted)
M3  (2 unrouted)
M4  (2 unrouted)
M5  (2 unrouted)
M6  (2 unrouted)
M7  (2 unrouted)
M8  (2 unrouted)
N$1  (3 unrouted)
N$2  (3 unrouted)
N$3  (1 unrouted)
N$4  (1 unrouted)
N$5  (1 unrouted)
N$6  (1 unrouted)
N$7  (1 unrouted)
N$8  (1 unrouted)
N$9  (1 unrouted)
N$10  (1 unrouted)
N$11  (1 unrouted)
N$12  (1 unrouted)
N$13  (1 unrouted)
N$14  (1 unrouted)
N$15  (1 unrouted)
N$16  (1 unrouted)
N$17  (1 unrouted)
N$18  (1 unrouted)
N$19  (1 unrouted)
N$20  (1 unrouted)
N$21  (1 unrouted)
N$23  (1 unrouted)
N$29  (1 unrouted)
N$30  (1 unrouted)
N$31  (1 unrouted)
N$32  (1 unrouted)
N$33  (1 unrouted)
N$34  (1 unrouted)
N$35  (1 unrouted)
N$36  (1 unrouted)
N$37  (1 unrouted)
N$38  (1 unrouted)
N$39  (1 unrouted)
N$40  (1 unrouted)
N$41  (1 unrouted)
N$42  (1 unrouted)
N$43  (1 unrouted)
N$44  (1 unrouted)
N$46  (1 unrouted)
NEO_P1  (1 unrouted)
NEO_P2  (1 unrouted)
NEO_P3  (1 unrouted)
NEO_P4  (1 unrouted)
NEO_P_CTRL  (1 unrouted)
NEO_P_CTRL_INT  (2 unrouted)
SCL  (2 unrouted)
SCL0  (3 unrouted)
SCL1  (3 unrouted)
SDA  (2 unrouted)
SDA0  (3 unrouted)
SDA1  (3 unrouted)
SHDN  (1 unrouted)

### Text on the board
tNames: 3.3V | AGND | BCLK | DATA | 3.3V | LRCLK | GND | BAT | SHDN | GND | 5V | GND | /Users/nathan/Desktop/moth_01.bmp | GND | CTRL | 5V | GND | GND | SIG | SIG | Moth v2.1 | Designed by / Nathan Villicana-Shaw | 2019
bNames: GND | GND | 3.3V | BCLK | DATA | LRCLK | Moth v2.1 | SHDN | BAT | GND | 5V